# Altium schematic sheet MCU.SchDoc
size A3; SheetNumber: 2; SheetTotal: 6
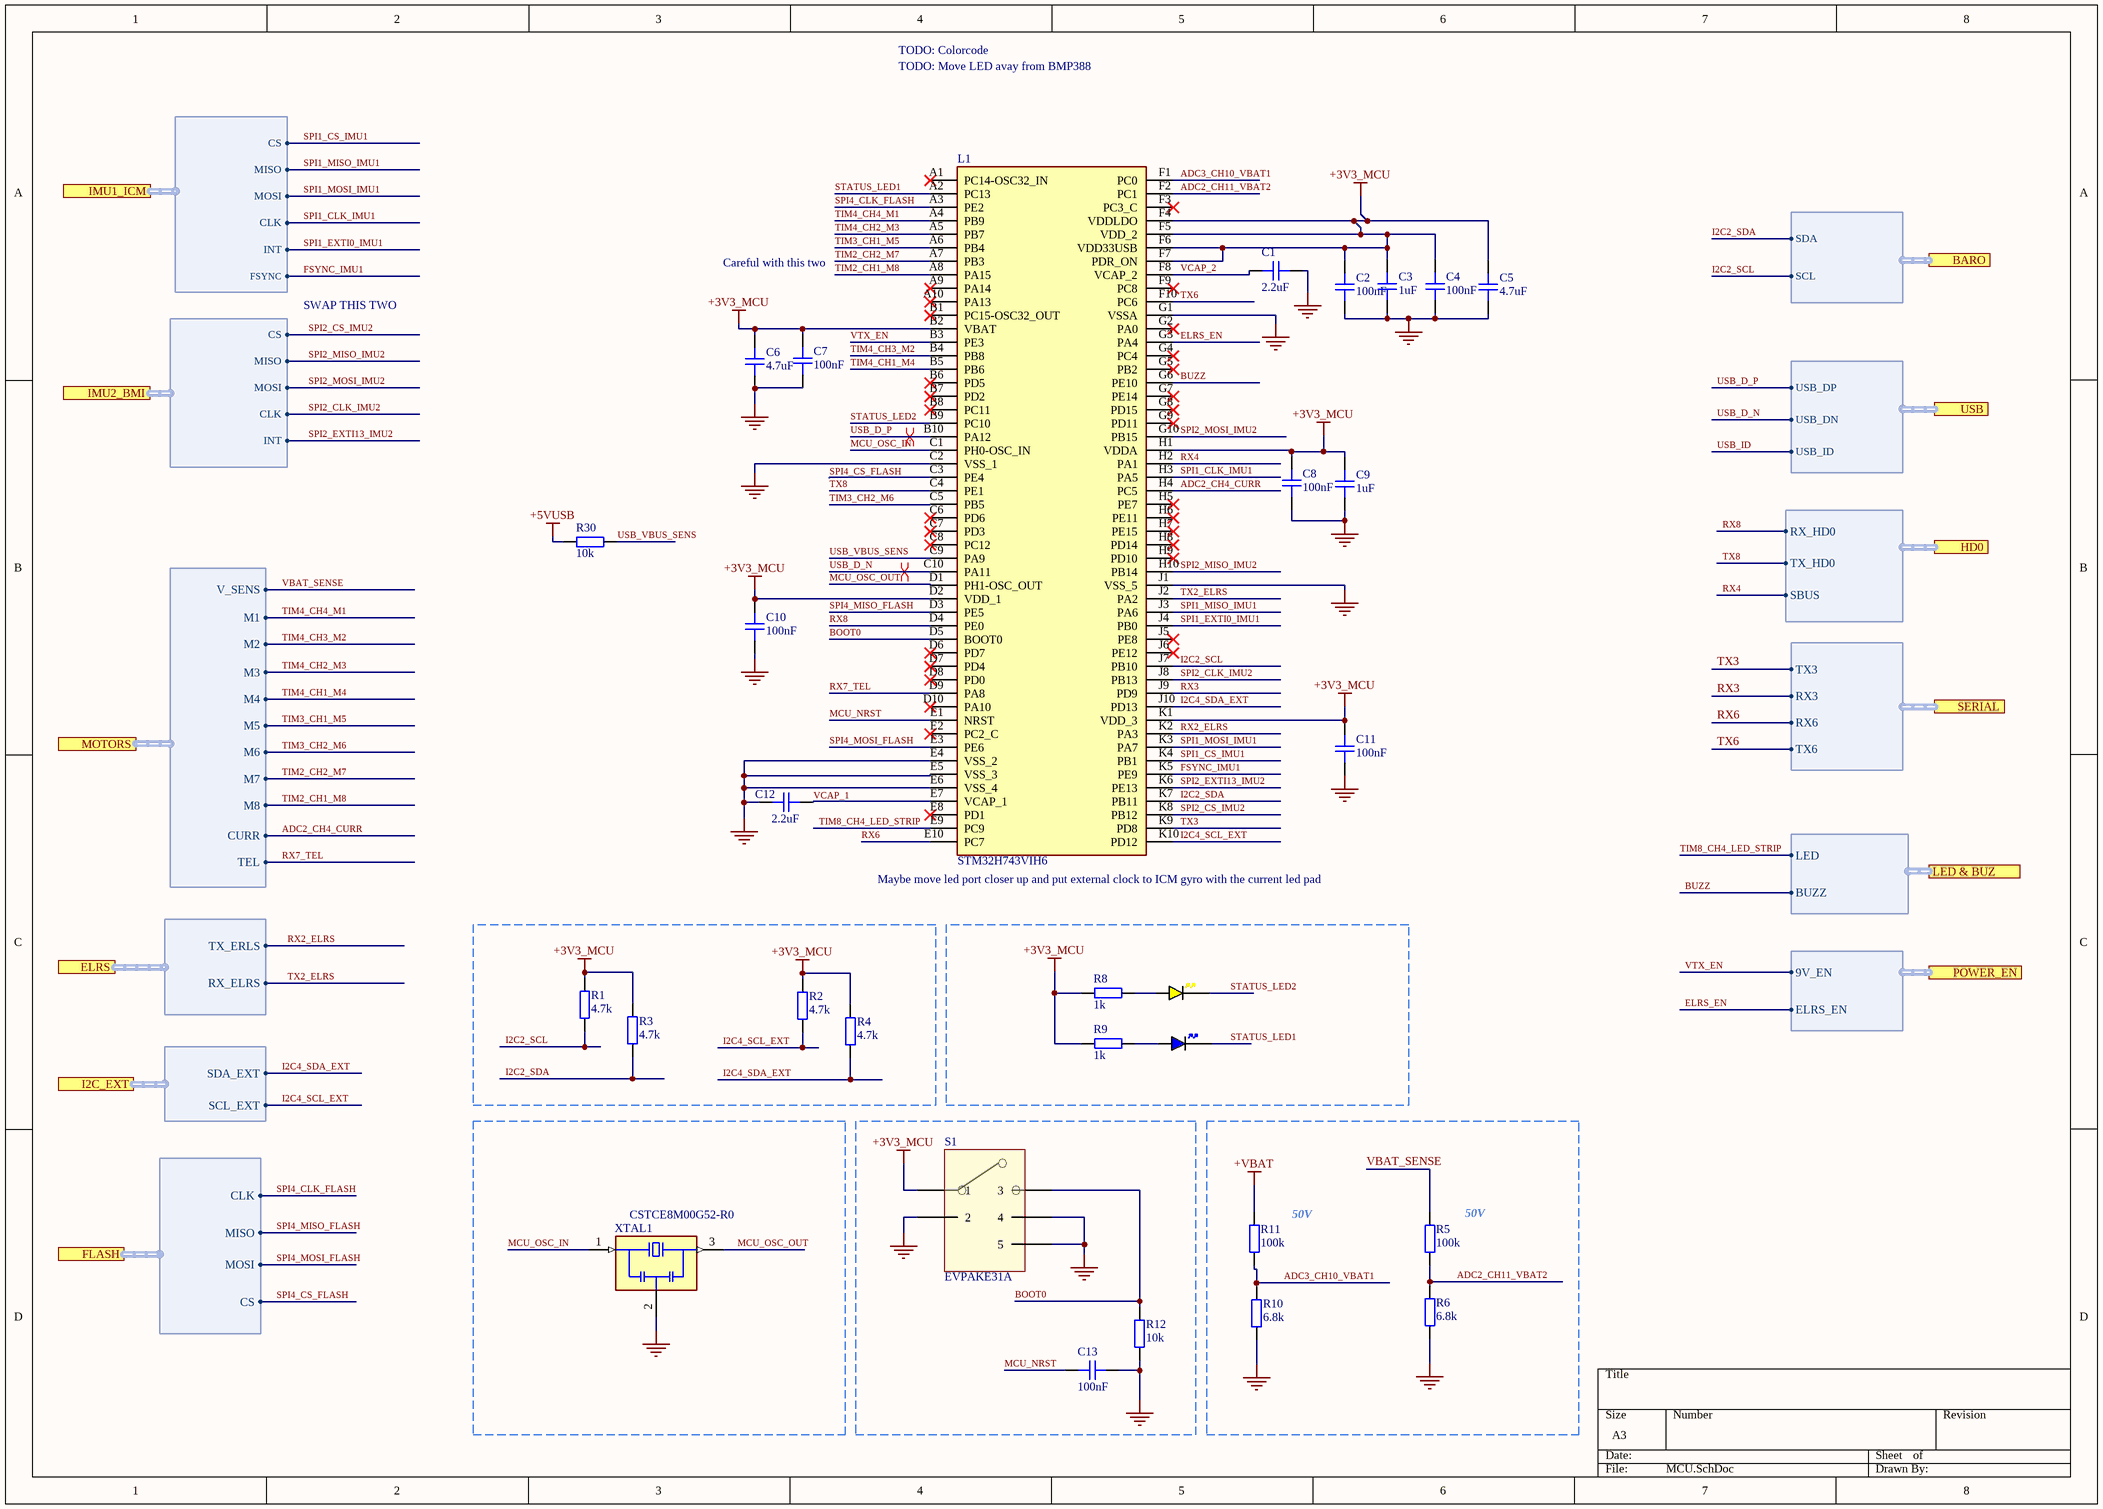
[diagram p0: MCU.SchDoc]

## Parts
C1  2.2uF  [CAP_0402]
C2  100nF  [CAP_0201]
C3  1uF  [CAP_0402]
C4  100nF  [CAP_0201]
C5  4.7uF  [CAP_0402]
C6  4.7uF  [CAP_0402]
C7  100nF  [CAP_0201]
C8  100nF  [CAP_0201]
C9  1uF  [CAP_0402]
C10  100nF  [CAP_0201]
C11  100nF  [CAP_0201]
C12  2.2uF  [CAP_0402]
C13  100nF  [CAP_0201]
L1  STM32H743VIH6  [BGA100C80P10X10_800X800X110]
LED1  YELLOW  [LED_0402_YELLOW]  (value not drawn)
LED2  BLUE  [LED_0402_BLUE]  (value not drawn)
R1  4.7k  [RES_0201]
R2  4.7k  [RES_0201]
R3  4.7k  [RES_0201]
R4  4.7k  [RES_0201]
R5  100k  [RES_0402]
R6  6.8k  [RES_0201]
R8  1k  [RES_0201]
R9  1k  [RES_0201]
R10  6.8k  [RES_0201]
R11  100k  [RES_0402]
R12  10k  [RES_0201]
R30  10k  [RES_0201]
S1  EVPAKE31A  [EVPAKE31A]
XTAL1  CSTCE8M00G52-R0  [OSC_CSTCE8M00G52-R0]

## Ports
BARO (harness I2C3_BARO, see Overview[3B], Peripherals[3A]), ELRS (harness ELRS, see Overview[3B], ELRS[2B]), FLASH (harness FLASH, see Overview[3B], Peripherals[3C]), HD0 (harness HD0, see Overview[3A], ExternalConnections[3C]), I2C_EXT (harness I2C_EXT, see Overview[3B], ExternalConnections[5C]), IMU1_ICM (harness IMU1, see Overview[2B], Peripherals[1A]), IMU2_BMI (harness IMU, see Overview[2B], Peripherals[1C]), LED & BUZ (harness MISC, see Overview[3B], ExternalConnections[5A]), MOTORS (harness MOTORS, see Overview[3A], ExternalConnections[1A]), POWER_EN (harness VTX_EN, see Overview[2A], PowerSupply[1B]), SERIAL (harness SERIAL, see Overview[3A], ExternalConnections[2C]), USB (harness USB, see Overview[3A], ExternalConnections[1C])

## Harnesses
SERIAL: TX3, RX3, RX6, TX6
I2C3_BARO: SDA, SCL
USB: USB_DP, USB_DN, USB_ID
IMU: CS, MISO, MOSI, CLK, INT
MOTORS: M2, M3, M4, M5, M6, M1, M7, M8, CURR, TEL, V_SENS
MISC: BUZZ, LED
I2C_EXT: SDA_EXT, SCL_EXT
IMU1: CS, MISO, MOSI, CLK, INT, FSYNC
ELRS: TX_ERLS, RX_ELRS
FLASH: CLK, MISO, MOSI, CS
HD0: RX_HD0, TX_HD0, SBUS
VTX_EN: 9V_EN, ELRS_EN

## Nets
+3V3_MCU: C2.2 C3.2 C4.2 C5.2 C6.2 C7.2 C8.2 C9.2 C10.2 C11.2 L1.B2(VBAT) L1.D2(VDD_1) L1.F4(VDDLDO) L1.F5(VDD_2) L1.F6(VDD33USB) L1.F7(PDR_ON) L1.H1(VDDA) L1.K1(VDD_3) R1.2 R2.2 R3.2 R4.2 R8.1 R9.1 S1.1
+5VUSB: R30.1
+VBAT: R11.2
GND: C1.2 C2.1 C3.1 C4.1 C5.1 C6.1 C7.1 C8.1 C9.1 C10.1 C11.1 C12.1 C13.2 L1.C2(VSS_1) L1.E4(VSS_2) L1.E5(VSS_3) L1.E6(VSS_4) L1.G1(VSSA) L1.J1(VSS_5) R6.1 R10.1 R12.1 S1.2 S1.4 S1.5 XTAL1.2(GND)
ADC2_CH4_CURR: L1.H4(PC5) ; port MOTORS.CURR
ADC2_CH11_VBAT2: L1.F2(PC1) R5.1 R6.2
ADC3_CH10_VBAT1: L1.F1(PC0) R10.2 R11.1
BOOT0: L1.D5(BOOT0) R12.2 S1.3
BUZZ: L1.G6(PE10) ; port LED & BUZ.BUZZ
ELRS_EN: L1.G3(PA4) ; port POWER_EN.ELRS_EN
FSYNC_IMU1: L1.K5(PE9) ; port IMU1_ICM.FSYNC
I2C2_SCL: L1.J7(PB10) R1.1 ; port BARO.SCL
I2C2_SDA: L1.K7(PB11) R3.1 ; port BARO.SDA
I2C4_SCL_EXT: L1.K10(PD12) R2.1 ; port I2C_EXT.SCL_EXT
I2C4_SDA_EXT: L1.J10(PD13) R4.1 ; port I2C_EXT.SDA_EXT
MCU_NRST: C13.1 L1.E1(NRST)
MCU_OSC_IN: L1.C1(PH0-OSC_IN) XTAL1.1(IN)
MCU_OSC_OUT: L1.D1(PH1-OSC_OUT) XTAL1.3(OUT)
RX2_ELRS: L1.K2(PA3) ; port ELRS.TX_ERLS
RX3: L1.J9(PD9) ; port SERIAL.RX3
RX4: L1.H2(PA1) ; port HD0.SBUS
RX6: L1.E10(PC7) ; port SERIAL.RX6
RX7_TEL: L1.D9(PA8) ; port MOTORS.TEL
RX8: L1.D4(PE0) ; port HD0.RX_HD0
SPI1_CLK_IMU1: L1.H3(PA5) ; port IMU1_ICM.CLK
SPI1_CS_IMU1: L1.K4(PB1) ; port IMU1_ICM.CS
SPI1_EXTI0_IMU1: L1.J4(PB0) ; port IMU1_ICM.INT
SPI1_MISO_IMU1: L1.J3(PA6) ; port IMU1_ICM.MISO
SPI1_MOSI_IMU1: L1.K3(PA7) ; port IMU1_ICM.MOSI
SPI2_CLK_IMU2: L1.J8(PB13) ; port IMU2_BMI.CLK
SPI2_CS_IMU2: L1.K8(PB12) ; port IMU2_BMI.CS
SPI2_EXTI13_IMU2: L1.K6(PE13) ; port IMU2_BMI.INT
SPI2_MISO_IMU2: L1.H10(PB14) ; port IMU2_BMI.MISO
SPI2_MOSI_IMU2: L1.G10(PB15) ; port IMU2_BMI.MOSI
SPI4_CLK_FLASH: L1.A3(PE2) ; port FLASH.CLK
SPI4_CS_FLASH: L1.C3(PE4) ; port FLASH.CS
SPI4_MISO_FLASH: L1.D3(PE5) ; port FLASH.MISO
SPI4_MOSI_FLASH: L1.E3(PE6) ; port FLASH.MOSI
STATUS_LED1: L1.A2(PC13) LED2.K
STATUS_LED2: L1.B9(PC10) LED1.K
TIM2_CH1_M8: L1.A8(PA15) ; port MOTORS.M8
TIM2_CH2_M7: L1.A7(PB3) ; port MOTORS.M7
TIM3_CH1_M5: L1.A6(PB4) ; port MOTORS.M5
TIM3_CH2_M6: L1.C5(PB5) ; port MOTORS.M6
TIM4_CH1_M4: L1.B5(PB6) ; port MOTORS.M4
TIM4_CH2_M3: L1.A5(PB7) ; port MOTORS.M3
TIM4_CH3_M2: L1.B4(PB8) ; port MOTORS.M2
TIM4_CH4_M1: L1.A4(PB9) ; port MOTORS.M1
TIM8_CH4_LED_STRIP: L1.E9(PC9) ; port LED & BUZ.LED
TX2_ELRS: L1.J2(PA2) ; port ELRS.RX_ELRS
TX3: L1.K9(PD8) ; port SERIAL.TX3
TX6: L1.F10(PC6) ; port SERIAL.TX6
TX8: L1.C4(PE1) ; port HD0.TX_HD0
USB_D_N: L1.C10(PA11) ; port USB.USB_DN
USB_D_P: L1.B10(PA12) ; port USB.USB_DP
USB_ID: port USB.USB_ID
USB_VBUS_SENS: L1.C9(PA9) R30.2
VBAT_SENSE: R5.2 ; port MOTORS.V_SENS
VCAP_1: C12.2 L1.E7(VCAP_1)
VCAP_2: C1.1 L1.F8(VCAP_2)
VTX_EN: L1.B3(PE3) ; port POWER_EN.9V_EN
NetLED1_A: LED1.A R8.2
NetLED2_A: LED2.A R9.2

Not connected (* = marked no-connect by the designer): L1 A1(PC14-OSC32_IN)* A9(PA14)* A10(PA13)* B1(PC15-OSC32_OUT)* B6(PD5)* B7(PD2)* B8(PC11)* C6(PD6)* C7(PD3)* C8(PC12)* D6(PD7)* D7(PD4)* D8(PD0)* D10(PA10)* E2(PC2_C)* E8(PD1)* F3(PC3_C)* F9(PC8)* G2(PA0)* G4(PC4)* G5(PB2)* G7(PE14)* G8(PD15)* G9(PD11)* H5(PE7)* H6(PE11)* H7(PE15)* H8(PD14)* H9(PD10)* J5(PE8)* J6(PE12)*

## Layout directives
differential pair: USB_D_N, USB_D_P

## Notes on the sheet
- TODO: Colorcode
- TODO: Move LED avay from BMP388
- SWAP THIS TWO
- Careful with this two
- (near L1) Maybe move led port closer up and put external clock to ICM gyro with the current led pad
- (near R11) 50V
- (near R5) 50V

## Library data of the parts
C1 C3 C5 C6 C9 C12 = CAP_0402: Capacitor SMD 0402; Manufacturer: *; Manufacturer Part Number: *; Distributor Link: *; LCSC: *; Rating: *; Dielectric: *
C2 C4 C7 C8 C10 C11 C13 = CAP_0201: Capacitor SMD 0201; Manufacturer: *; Manufacturer Part Number: *; Distributor Link: *; LCSC: *; Rating: *; Dielectric: *
L1 = STM32H743VIH6: Inductor; Manufacturer_Name: STMicroelectronics; Datasheet Link: https://www.st.com/resource/en/datasheet/stm32h743vi.pdf; Height: 1.1mm; Manufacturer_Part_Number: STM32H743VIH6; Mouser Part Number: 511-STM32H743VIH6; Mouser Price/Stock: https://www.mouser.co.uk/ProductDetail/STMicroelectronics/STM32H743VIH6?qs=EU6FO9ffTwep%252BmI4YnA3%2Fw%3D%3D; Arrow Part Number: STM32H743VIH6; Arrow Price/Stock: https://www.arrow.com/en/products/stm32h743vih6/stmicroelectronics?region=nac
LED1 = LED_0402_YELLOW: LED 0402 YELLOW SMD
LED2 = LED_0402_BLUE: LED 0402 BLUE SMD
R1-R4 R6 R8-R10 R12 R30 = RES_0201: Resistor SMD 0201; Manufacturer: *; Manufacturer Part Number: *; Distributor Link: *; LCSC: *
R5 R11 = RES_0402: Resistor SMD 0402; Manufacturer: *; Manufacturer Part Number: *; Distributor Link: *; LCSC: *
XTAL1 = CSTCE8M00G52-R0: 8MHz Ceramic Resonator Built in Capacitor 10pF Â±0.2% -20Â°C ~ 80Â°C Surface Mount; MF: Murata; Price: None; Check_prices: https://www.snapeda.com/parts/CSTCE8M00G52-R0/Murata%20Electronics%20North%20America/view-part/234504/?ref=eda; SnapEDA_Link: https://www.snapeda.com/parts/CSTCE8M00G52-R0/Murata%20Electronics%20North%20America/view-part/234504/?ref=snap; Package: Surface Mount Murata Electronics North America; Availability: Bad; MP: CSTCE8M00G52-R0; Value: *